# Altium project rota.PrjPCB
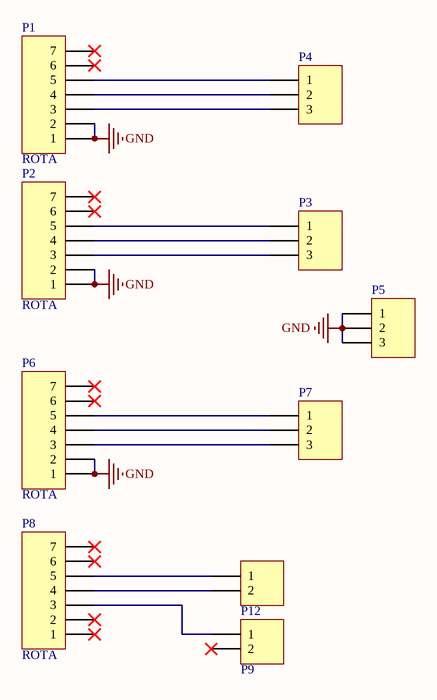
[diagram p0: rota.SchDoc]
1 sheet, 10 parts. Net scope: global (net labels, ports and power ports of the same name join across sheets).
Board files: rota.PcbDoc, rota1.PcbDoc, rota2.PcbDoc

## Sheet rota.SchDoc
size A4

### Parts
P1  ROTA  [rotation_key]
P2  ROTA  [rotation_key]
P3  Header 3  [ROTA-3PIN]  (value not drawn)
P4  Header 3  [ROTA-3PIN]  (value not drawn)
P5  Header 3  [ROTA-3PIN]  (value not drawn)
P6  ROTA  [rotation_key]
P7  Header 3  [ROTA-3PIN]  (value not drawn)
P8  ROTA  [rotation_key]
P9  Header 2  [ROTA-2PIN]  (value not drawn)
P12  Header 2  [ROTA-2PIN]  (value not drawn)

### Nets
GND: P1.1 P1.2 P2.1 P2.2 P5.1 P5.2 P5.3 P6.1 P6.2
NetP1_3: P1.3 P4.3
NetP1_4: P1.4 P4.2
NetP1_5: P1.5 P4.1
NetP2_3: P2.3 P3.3
NetP2_4: P2.4 P3.2
NetP2_5: P2.5 P3.1
NetP6_3: P6.3 P7.3
NetP6_4: P6.4 P7.2
NetP6_5: P6.5 P7.1
NetP8_3: P8.3 P9.1
NetP8_4: P8.4 P12.2
NetP8_5: P8.5 P12.1

Not connected (* = marked no-connect by the designer): P1 6* 7*; P2 6* 7*; P6 6* 7*; P8 1* 2* 6* 7*; P9 2*

### Library data of the parts
P1 P2 P6 P8 = Header 7: Header, 7-Pin; LatestRevisionDate: 17-Jul-2002; LatestRevisionNote: Re-released for DXP Platform.; Publisher: Altium Limited
P3-P5 P7 = Header 3: Header, 3-Pin; LatestRevisionDate: 17-Jul-2002; LatestRevisionNote: Re-released for DXP Platform.; Publisher: Altium Limited
P9 P12 = Header 2: Header, 2-Pin; LatestRevisionDate: 17-Jul-2002; LatestRevisionNote: Re-released for DXP Platform.; Publisher: Altium Limited